# EAGLE design connector (EAGLE 7.7.0)
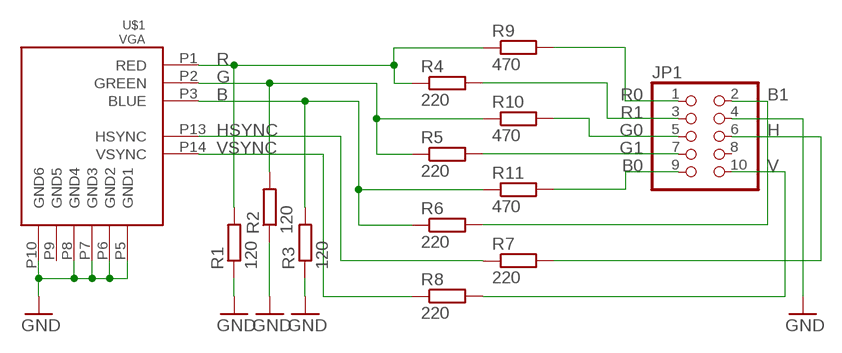
[diagram p0: schematic, sheet 1]

## Parts
JP1  PINHD-2X5  [2X05]
R1  120  R-EU_0204/7  [0204/7]
R2  120  R-EU_0204/7  [0204/7]
R3  120  R-EU_0204/7  [0204/7]
R4  220  R-EU_0204/7  [0204/7]
R5  220  R-EU_0204/7  [0204/7]
R6  220  R-EU_0204/7  [0204/7]
R7  220  R-EU_0204/7  [0204/7]
R8  220  R-EU_0204/7  [0204/7]
R9  470  R-EU_0204/7  [0204/7]
R10  470  R-EU_0204/7  [0204/7]
R11  470  R-EU_0204/7  [0204/7]
U$1  VGA  [FCI_DSUB_HD_15_RA]

## Nets
B: R3.2 R6.1 R11.1 U$1.P3(BLUE)
B0: JP1.9 R11.2
B1: JP1.2 R6.2
G: R2.2 R5.1 R10.1 U$1.P2(GREEN)
G0: JP1.5 R10.2
G1: JP1.7 R5.2
GND: JP1.4 R1.1 R2.1 R3.1 U$1.P5(GND1) U$1.P6(GND2) U$1.P7(GND3) U$1.P8(GND4) U$1.P10(GND6)
H: JP1.6 R7.2
HSYNC: R7.1 U$1.P13(HSYNC)
R: R1.2 R4.1 R9.1 U$1.P1(RED)
R0: JP1.1 R9.2
R1: JP1.3 R4.2
V: JP1.10 R8.2
VSYNC: R8.1 U$1.P14(VSYNC)
Unconnected: JP1.8 U$1.P9(GND5)

## Library data of the parts
JP1 = pinhead:PINHD-2X5: PIN HEADER
R1-R11 = resistor:R-EU_: RESISTOR, European symbol
U$1 = bt_electromech:VGA: VGA Connector

## Net classes
0 default: width 0.305 mm, drill 0.305 mm, clearance 0.305 mm

## Board
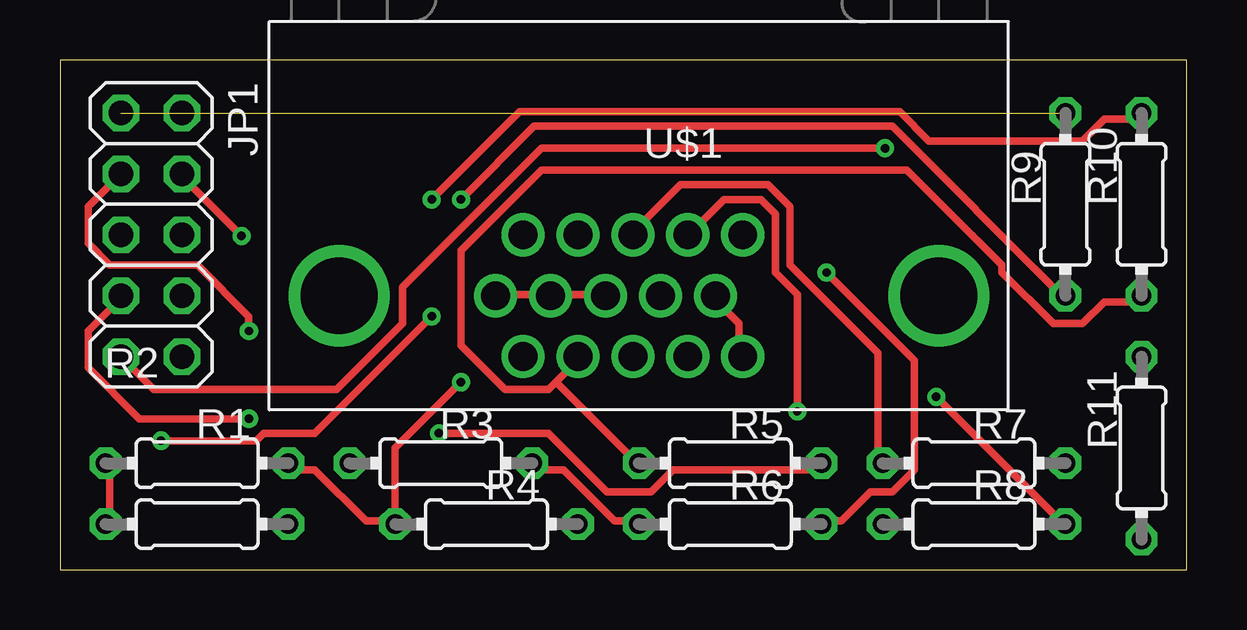
[diagram p1: board, top side]
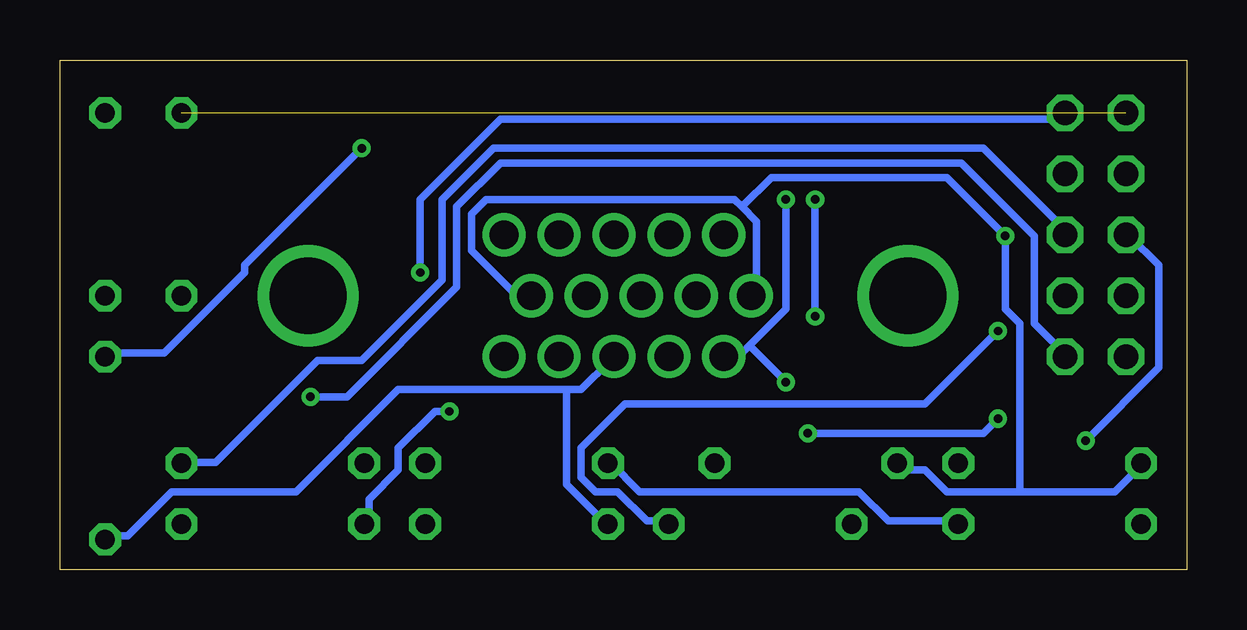
[diagram p2: board, bottom side, seen from below]

Size 46.97 x 21.26 mm. Coordinates in mm from the lower left corner, seen from the top.
Outline: 0,0 46.97,0 46.97,21.26 0,21.26 0,0
Copper layers (1*16): Top 0.035mm / dielectric 1.5mm / Bottom 0.035mm
Design rules "default *": minimum track width 6mil, minimum drill 0.35mm, track to track 6mil, track to pad 6mil, pad to pad 6mil, via to via 6mil, smd to smd 6mil, copper to edge 40mil, drill to drill 6mil, minimum pad ring 10mil, minimum via ring 8mil, stop-mask expansion 4mil, vias tented up to drill 0mil, thermal gap 10mil

### Footprints (pad centres in the part's own frame; a part is rotated, then mirrored left to right if it is on the bottom)
2X05 = drill 1.016 octagon: 1 -5.08,-1.27; 2 -5.08,1.27; 3 -2.54,-1.27; 4 -2.54,1.27; 5 0,-1.27; 6 0,1.27; 7 2.54,-1.27; 8 2.54,1.27; 9 5.08,-1.27; 10 5.08,1.27
0204/7 = drill 0.813 octagon: 1 -3.81,0; 2 3.81,0
FCI_DSUB_HD_15_RA = drill 1.2: P1 4.83,2.54; P2 2.54,2.54; P3 0.25,2.54; P4 -2.04,2.54; P5 -4.33,2.54; P6 5.97,0; P7 3.68,0; P8 1.39,0; P9 -0.9,0; P10 -3.19,0; P11 4.83,-2.54; P12 2.54,-2.54; P13 0.25,-2.54; P14 -2.04,-2.54; P15 -4.33,-2.54 | drill 3.2: P$13 -12.5,0; P$14 12.5,0

### Placement (x,y rotation side)
JP1  3.81,13.97 270 top
R1  5.71,4.45 0 top
R2  5.71,1.91 0 top
R3  15.88,4.45 0 top
R4  17.78,1.91 0 top
R5  27.94,4.45 0 top
R6  27.94,1.91 0 top
R7  38.1,4.45 0 top
R8  38.1,1.91 0 top
R9  41.91,15.24 90 top
R10  45.09,15.24 90 top
R11  45.09,5.08 90 top
U$1  24.13,11.43 180 top

### Tracks (layer width: path | path; a pad name or v marks a point on that pad's centre or on a via)
B
  Top 0.305: R3.2 19.76,4.17 20.98,4.17 23.11,2.03 24.03,2.03 R6.1
  Bottom 0.305: 25.86,7.52 25.25,7.52 24.03,8.74 U$1.P3 | 25.86,7.52 32.87,7.52 37.13,3.25 42.32,3.25 44.14,1.42 45.06,1.42 R11.1 | 25.86,7.52 25.86,3.56 24.33,2.03 R6.1
B0  (via drill 0.35)
  Top 0.305: v34.39,17.58 20.07,17.58 14.27,11.79 14.27,10.26 11.53,7.52 3.91,7.52 JP1.9
  Bottom 0.305: v34.39,17.58 39.27,12.7 39.27,12.4 42.62,9.04 45.06,9.04 R11.2
B1  (via drill 0.35)
  Top 0.305: v31.95,12.4 35.61,8.74 35.61,4.17 34.7,3.25 33.78,3.25 32.56,2.03 31.95,2.03 R6.2
  Bottom 0.305: v31.95,12.4 31.95,15.44 28.6,18.8 5.13,18.8 JP1.2
G
  Top 0.305: 20.68,7.82 21.59,8.74 U$1.P2 | 20.68,7.82 20.37,7.52 18.54,7.52 16.71,9.35 16.71,13.31 20.07,16.66 35.31,16.66 39.27,12.7 39.27,12.4 41.4,10.26 42.62,10.26 43.54,11.18 45.06,11.18 R10.1 | 20.68,7.82 24.03,4.47 R5.1
  Bottom 0.305: R2.2 9.7,2.03 12.45,2.03 13.66,3.25 22.81,3.25 24.03,4.47 R5.1
G0  (via drill 0.35)
  Top 0.305: v15.49,15.44 19.15,19.1 35,19.1 36.22,17.88 42.62,17.88 43.54,18.8 45.06,18.8 R10.2 | v15.49,10.57 10.62,5.69 8.48,5.69 8.18,5.39 v4.22,5.39
  Bottom 0.305: v15.49,10.57 v15.49,15.44 | v4.22,5.39 1.17,8.43 1.17,12.7 2.39,13.92 JP1.5
G1  (via drill 0.35)
  Top 0.305: v15.8,5.69 20.37,5.69 22.81,3.25 24.64,3.25 25.55,4.17 31.65,4.17 R5.2 | v7.87,6.3 3.3,6.3 1.17,8.43 1.17,9.96 2.39,11.18 JP1.7
  Bottom 0.305: v15.8,5.69 8.48,5.69 v7.87,6.3
GND  (via drill 0.35)
  Top 0.305: U$1.P5 28.3,9.04 28.3,10.26 27.38,11.18 U$1.P10 | U$1.P6 18.24,11.48 20.37,11.48 U$1.P7 20.68,11.48 22.5,11.48 U$1.P8 | R2.1 2.08,2.03 2.08,4.17 R1.1 | v7.57,13.92 5.13,16.36 JP1.4
  Bottom 0.305: 18.54,15.14 17.93,14.53 17.93,11.48 U$1.P6 | 18.54,15.14 18.85,15.44 29.21,15.44 29.82,14.83 29.82,13.31 27.99,11.48 27.38,11.48 U$1.P10 | 6.96,3.25 3,3.25 2.08,4.17 R1.1 | 6.96,3.25 10.01,3.25 10.92,4.17 11.84,4.17 R3.1 | 6.96,3.25 6.96,10.26 7.57,10.87 v7.57,13.92 10.01,16.36 17.32,16.36 18.54,15.14
H
  Bottom 0.305: R7.2 41.71,4.47 40.49,4.47 36.22,8.74 34.39,8.74 31.04,12.09 31.04,15.44 28.91,17.58 8.48,17.58 5.13,14.22 JP1.6
HSYNC
  Top 0.305: R7.1 34.09,4.47 34.09,9.04 30.43,12.7 30.43,15.14 29.52,16.05 25.86,16.05 24.03,14.22 U$1.P13
R  (via drill 0.35)
  Top 0.305: 13.97,2.03 12.75,2.03 10.62,4.17 9.7,4.17 R1.2 | v16.71,15.44 19.76,18.49 34.7,18.49 41.71,11.48 R9.1 | 13.97,2.03 13.97,5.08 v16.71,7.82 | 13.97,2.03 R4.1
  Bottom 0.305: v16.71,15.44 16.71,10.87 18.24,9.35 | 18.24,9.35 18.54,9.04 19.15,9.04 U$1.P1 | 18.24,9.35 v16.71,7.82
R0  (1 unrouted)
R1  (via drill 0.35)
  Top 0.305: v7.87,9.96 7.87,10.57 5.74,12.7 2.08,12.7 1.17,13.61 1.17,15.14 JP1.3
  Bottom 0.305: v7.87,9.96 10.92,6.91 23.42,6.91 25.25,5.08 25.25,3.86 24.64,3.25 23.72,3.25 22.5,2.03 21.59,2.03 R4.2
V  (via drill 0.35)
  Top 0.305: v36.52,7.21 41.71,2.03 R8.2
  Bottom 0.305: v36.52,7.21 35,7.21 30.43,11.79 30.43,15.14 28.6,16.97 9.4,16.97 6.35,13.92 6.35,10.26 5.13,9.04 JP1.10
VSYNC  (via drill 0.35)
  Top 0.305: v30.73,6.6 30.73,11.48 29.82,12.4 29.82,14.83 29.21,15.44 27.69,15.44 26.47,14.22 U$1.P14
  Bottom 0.305: v30.73,6.6 31.34,6.6 32.87,5.08 32.87,4.17 34.09,2.95 34.09,2.03 R8.1